# EAGLE design zxuno (EAGLE 6.5.0)
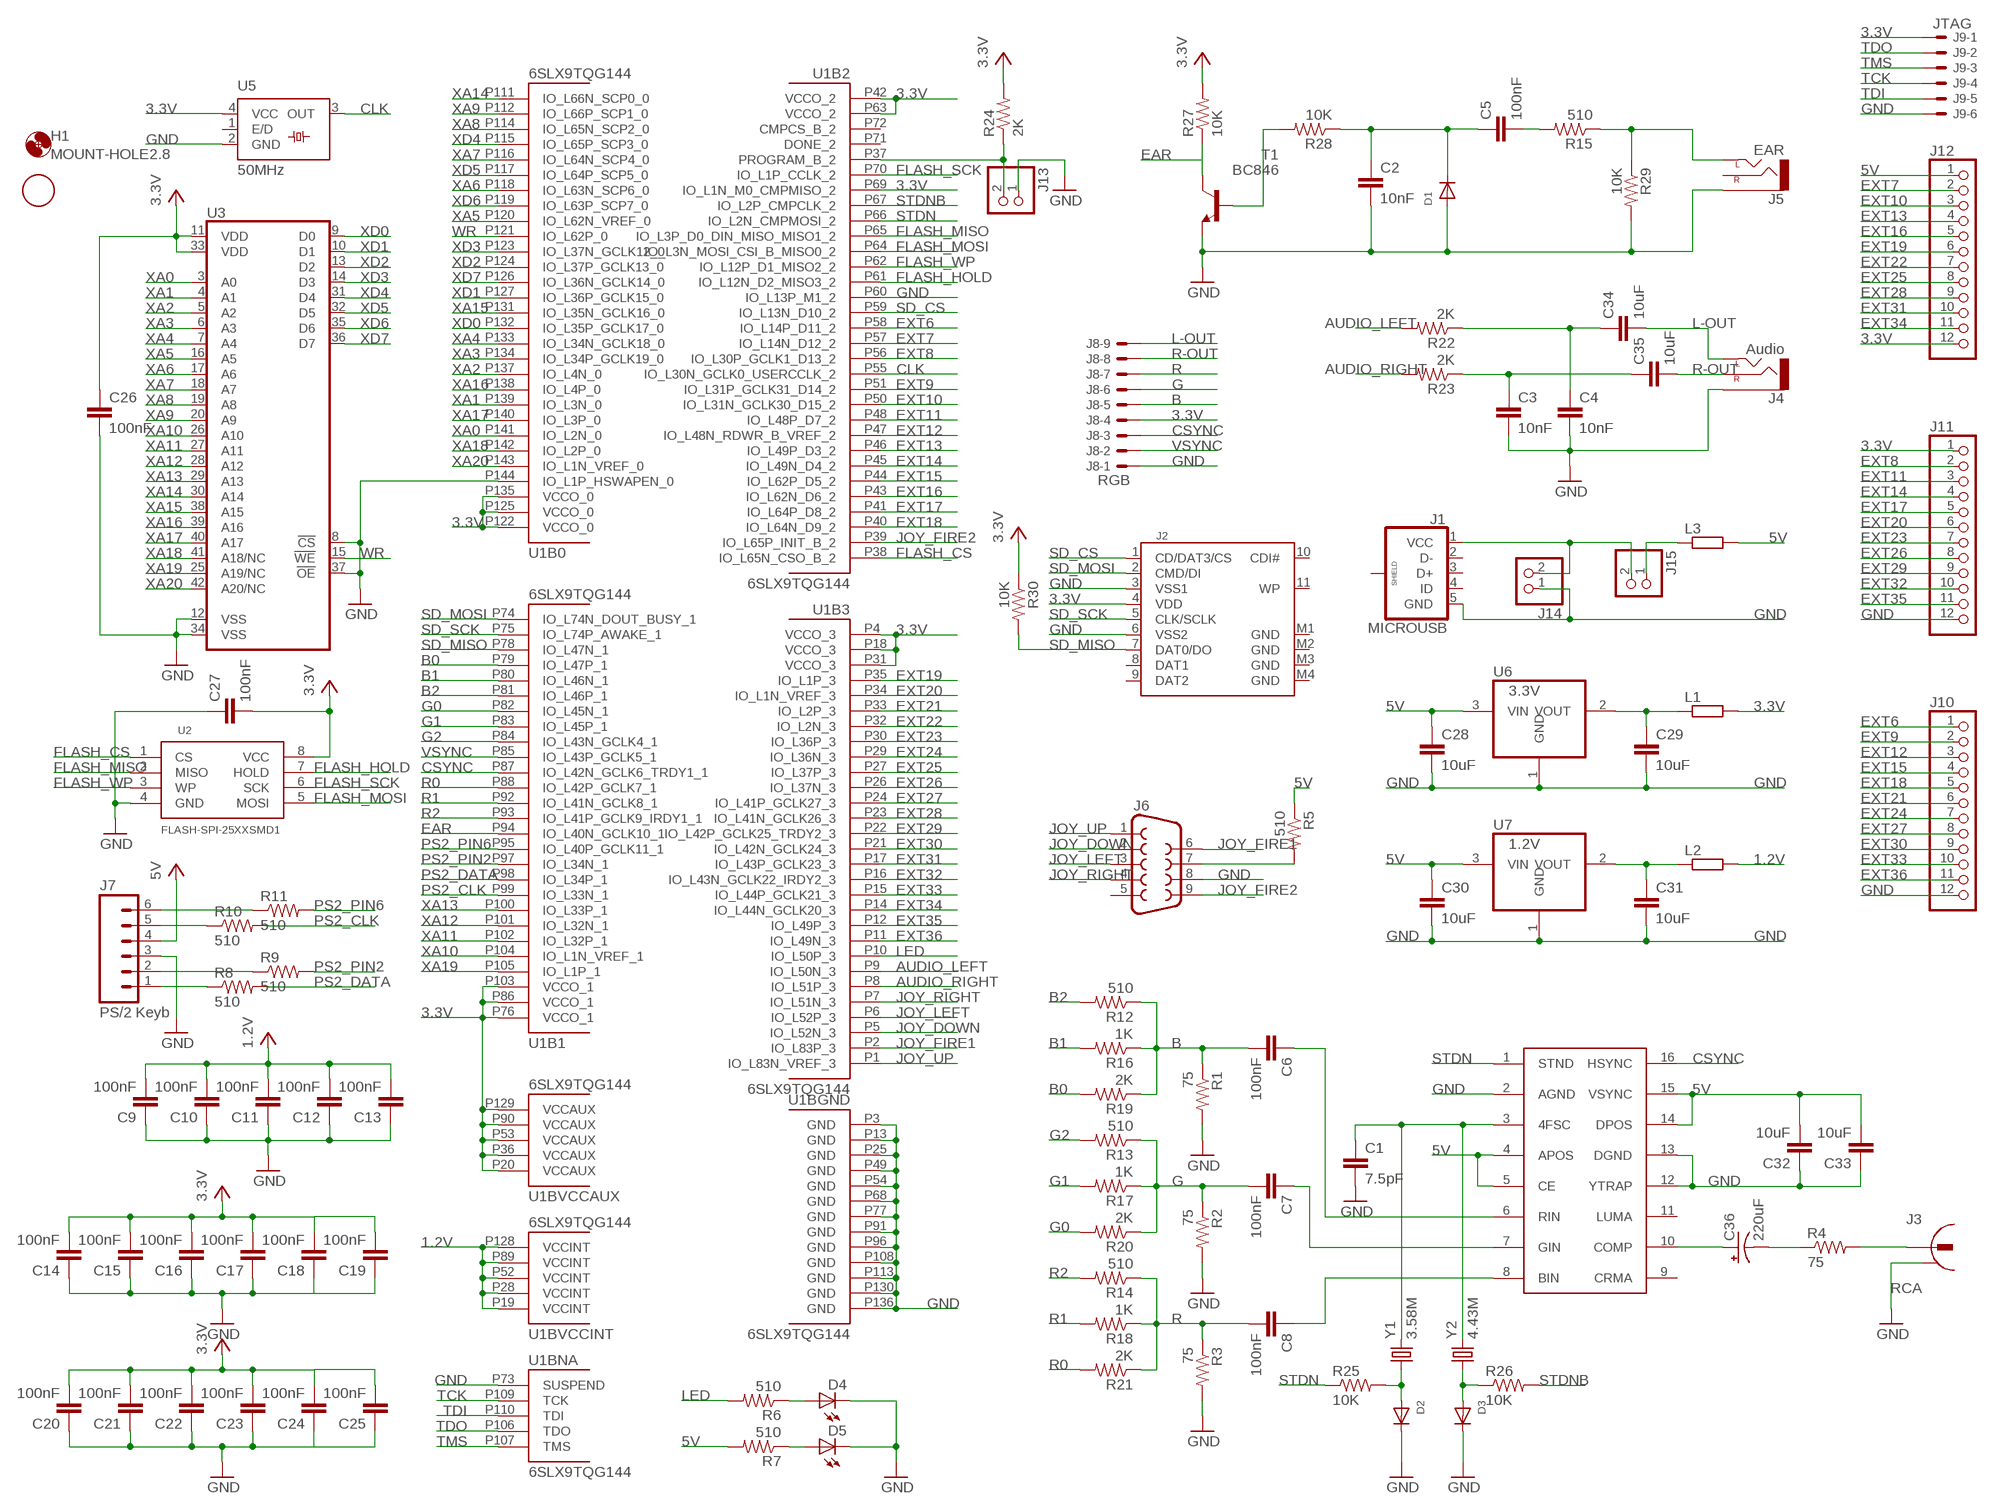
[diagram p0: schematic, sheet 1]

## Parts
C1  7.5pF  C-EUC0805  [C0805]
C2  10nF  C-EUC0805  [C0805]
C3  10nF  C-EUC0805  [C0805]
C4  10nF  C-EUC0805  [C0805]
C5  100nF  C-EUC0603  [C0603]
C6  100nF  C-EUC0603  [C0603]
C7  100nF  C-EUC0603  [C0603]
C8  100nF  C-EUC0603  [C0603]
C9  100nF  C-EUC0603  [C0603]
C10  100nF  C-EUC0603  [C0603]
C11  100nF  C-EUC0603  [C0603]
C12  100nF  C-EUC0603  [C0603]
C13  100nF  C-EUC0603  [C0603]
C14  100nF  C-EUC0603  [C0603]
C15  100nF  C-EUC0603  [C0603]
C16  100nF  C-EUC0603  [C0603]
C17  100nF  C-EUC0603  [C0603]
C18  100nF  C-EUC0603  [C0603]
C19  100nF  C-EUC0603  [C0603]
C20  100nF  C-EUC0603  [C0603]
C21  100nF  C-EUC0603  [C0603]
C22  100nF  C-EUC0603  [C0603]
C23  100nF  C-EUC0603  [C0603]
C24  100nF  C-EUC0603  [C0603]
C25  100nF  C-EUC0603  [C0603]
C26  100nF  C-EUC0603  [C0603]
C27  100nF  C-EUC0603  [C0603]
C28  10uF  C-EUC0805  [C0805]
C29  10uF  C-EUC0805  [C0805]
C30  10uF  C-EUC0805  [C0805]
C31  10uF  C-EUC0805  [C0805]
C32  10uF  C-EUC0805  [C0805]
C33  10uF  C-EUC0805  [C0805]
C34  10uF  C-EUC0805  [C0805]
C35  10uF  C-EUC0805  [C0805]
C36  220uF  CPOL-US153CLV-0605  [153CLV-0605]
D1  DIODESOD-523  [SOD-523]
D2  DIODESOD-523  [SOD-523]
D3  DIODESOD-523  [SOD-523]
D4  LEDCHIP-LED0805  [CHIP-LED0805]
D5  LEDCHIP-LED0805  [CHIP-LED0805]
H1  MOUNT-HOLE2.8  [2,8]
J1  MICROUSB  [MICRO_USB_1PRIMARY]
J2  SDCARD  [SDCMF-10915W010]
J3  RCA  RCA_JACK_RCJ-04X_-_DUPLICATE_1  [RCA_JACK_RCJ-04X_-_DUPLICATE_1PRIMARY]
J4  Audio  AUDIO-JACKPTH  [AUDIO-JACK]
J5  EAR  AUDIO-JACKPTH  [AUDIO-JACK]
J6  DB9MALE  [DB9_MALE]
J7  PS/2 Keyb  DINC_MIN_TM_6_1  [DINC/MIN_TM/6_1PRIMARY]
J8  RGB  53048-09  [53048-09]
J9  JTAG  53047-06  [53047-06]
J10  PINHD-1X12  [1X12]
J11  PINHD-1X12  [1X12]
J12  PINHD-1X12  [1X12]
J13  PINHD-1X2  [1X02]
J14  PINHD-1X2  [1X02]
J15  PINHD-1X2  [1X02]
L1  R-EU_M0805  [M0805]
L2  R-EU_M0805  [M0805]
L3  R-EU_M0805  [M0805]
R1  75  R-US_M0805  [M0805]
R2  75  R-US_M0805  [M0805]
R3  75  R-US_M0805  [M0805]
R4  75  R-US_M0805  [M0805]
R5  510  R-US_M0805  [M0805]
R6  510  R-US_M0805  [M0805]
R7  510  R-US_M0805  [M0805]
R8  510  R-US_M0805  [M0805]
R9  510  R-US_M0805  [M0805]
R10  510  R-US_M0805  [M0805]
R11  510  R-US_M0805  [M0805]
R12  510  R-US_M0805  [M0805]
R13  510  R-US_M0805  [M0805]
R14  510  R-US_M0805  [M0805]
R15  510  R-US_M0805  [M0805]
R16  1K  R-US_M0805  [M0805]
R17  1K  R-US_M0805  [M0805]
R18  1K  R-US_M0805  [M0805]
R19  2K  R-US_M0805  [M0805]
R20  2K  R-US_M0805  [M0805]
R21  2K  R-US_M0805  [M0805]
R22  2K  R-US_M0805  [M0805]
R23  2K  R-US_M0805  [M0805]
R24  2K  R-US_M0805  [M0805]
R25  10K  R-US_M0805  [M0805]
R26  10K  R-US_M0805  [M0805]
R27  10K  R-US_M0805  [M0805]
R28  10K  R-US_M0805  [M0805]
R29  10K  R-US_M0805  [M0805]
R30  10K  R-US_M0805  [M0805]
T1  BC846  [SOT23]
U1  6SLX9TQG144  [TQ144]
U2  FLASH-SPI-25XXSMD1  [SO08-EIAJ]
U3  ISSI_SRAM_8BIT  [TSOP44-II]
U4  AD724  AD725  [SO16W]
U5  50MHz  SM_OSC_1  [SM/OSC_1PRIMARY]
U6  3.3V  REG1117  [SOT223]
U7  1.2V  REG1117  [SOT223]
U$1  FIDUCIAL  [FIDUCIAL_1MM]
Y1  3.58M  CRYSTALHC49UP  [HC49UP]
Y2  4.43M  CRYSTALHC49UP  [HC49UP]

## Nets
1.2V: C9.2 C10.2 C11.2 C12.2 C13.2 L2.2 U1.P19(BVCCINT:VCCINT) U1.P28(BVCCINT:VCCINT) U1.P52(BVCCINT:VCCINT) U1.P89(BVCCINT:VCCINT) U1.P128(BVCCINT:VCCINT)
3.3V: C14.2 C15.2 C16.2 C17.2 C18.2 C19.2 C20.2 C21.2 C22.2 C23.2 C24.2 C25.2 C26.1 C27.2 J2.4(VDD) J8.4 J9.1 J11.1 J12.12 L1.2 R24.2 R27.2 R30.1 U1.P4(B3:VCCO_3) U1.P18(B3:VCCO_3) U1.P20(BVCCAUX:VCCAUX) U1.P31(B3:VCCO_3) U1.P36(BVCCAUX:VCCAUX) U1.P42(B2:VCCO_2) U1.P53(BVCCAUX:VCCAUX) U1.P63(B2:VCCO_2) U1.P69(B2:IO_L1N_M0_CMPMISO_2) U1.P76(B1:VCCO_1) U1.P86(B1:VCCO_1) U1.P90(BVCCAUX:VCCAUX) U1.P103(B1:VCCO_1) U1.P122(B0:VCCO_0) U1.P125(B0:VCCO_0) U1.P129(BVCCAUX:VCCAUX) U1.P135(B0:VCCO_0) U2.8(VCC) U3.11(VDD) U3.33(VDD) U5.4(VCC)
5V: C28.1 C30.1 C32.2 C33.2 J7.4 J12.1 L3.2 R5.1 R7.2 U4.4(APOS) U4.5(CE) U4.14(DPOS) U4.15(VSYNC) U6.3(VIN) U7.3(VIN)
AUDIO_LEFT: R22.2 U1.P9(B3:IO_L50N_3)
AUDIO_RIGHT: R23.2 U1.P8(B3:IO_L51P_3)
B: C6.2 J8.5 R1.1 R12.1 R16.1 R19.1
B0: R19.2 U1.P79(B1:IO_L47P_1)
B1: R16.2 U1.P80(B1:IO_L46N_1)
B2: R12.2 U1.P81(B1:IO_L46P_1)
CLK: U1.P55(B2:IO_L30N_GCLK0_USERCCLK_2) U5.3(OUT)
CSYNC: J8.3 U1.P87(B1:IO_L42N_GCLK6_TRDY1_1) U4.16(HSYNC)
EAR: R27.1 T1.3(C) U1.P94(B1:IO_L40N_GCLK10_1)
EXT6: J10.1 U1.P58(B2:IO_L14P_D11_2)
EXT7: J12.2 U1.P57(B2:IO_L14N_D12_2)
EXT8: J11.2 U1.P56(B2:IO_L30P_GCLK1_D13_2)
EXT9: J10.2 U1.P51(B2:IO_L31P_GCLK31_D14_2)
EXT10: J12.3 U1.P50(B2:IO_L31N_GCLK30_D15_2)
EXT11: J11.3 U1.P48(B2:IO_L48P_D7_2)
EXT12: J10.3 U1.P47(B2:IO_L48N_RDWR_B_VREF_2)
EXT13: J12.4 U1.P46(B2:IO_L49P_D3_2)
EXT14: J11.4 U1.P45(B2:IO_L49N_D4_2)
EXT15: J10.4 U1.P44(B2:IO_L62P_D5_2)
EXT16: J12.5 U1.P43(B2:IO_L62N_D6_2)
EXT17: J11.5 U1.P41(B2:IO_L64P_D8_2)
EXT18: J10.5 U1.P40(B2:IO_L64N_D9_2)
EXT19: J12.6 U1.P35(B3:IO_L1P_3)
EXT20: J11.6 U1.P34(B3:IO_L1N_VREF_3)
EXT21: J10.6 U1.P33(B3:IO_L2P_3)
EXT22: J12.7 U1.P32(B3:IO_L2N_3)
EXT23: J11.7 U1.P30(B3:IO_L36P_3)
EXT24: J10.7 U1.P29(B3:IO_L36N_3)
EXT25: J12.8 U1.P27(B3:IO_L37P_3)
EXT26: J11.8 U1.P26(B3:IO_L37N_3)
EXT27: J10.8 U1.P24(B3:IO_L41P_GCLK27_3)
EXT28: J12.9 U1.P23(B3:IO_L41N_GCLK26_3)
EXT29: J11.9 U1.P22(B3:IO_L42P_GCLK25_TRDY2_3)
EXT30: J10.9 U1.P21(B3:IO_L42N_GCLK24_3)
EXT31: J12.10 U1.P17(B3:IO_L43P_GCLK23_3)
EXT32: J11.10 U1.P16(B3:IO_L43N_GCLK22_IRDY2_3)
EXT33: J10.10 U1.P15(B3:IO_L44P_GCLK21_3)
EXT34: J12.11 U1.P14(B3:IO_L44N_GCLK20_3)
EXT35: J11.11 U1.P12(B3:IO_L49P_3)
EXT36: J10.11 U1.P11(B3:IO_L49N_3)
FLASH_CS: U1.P38(B2:IO_L65N_CSO_B_2) U2.1(CS)
FLASH_HOLD: U1.P61(B2:IO_L12N_D2_MISO3_2) U2.7(HOLD)
FLASH_MISO: U1.P65(B2:IO_L3P_D0_DIN_MISO_MISO1_2) U2.2(MISO)
FLASH_MOSI: U1.P64(B2:IO_L3N_MOSI_CSI_B_MISO0_2) U2.5(MOSI)
FLASH_SCK: U1.P70(B2:IO_L1P_CCLK_2) U2.6(SCK)
FLASH_WP: U1.P62(B2:IO_L12P_D1_MISO2_2) U2.3(WP)
G: C7.2 J8.6 R2.1 R13.1 R17.1 R20.1
G0: R20.2 U1.P82(B1:IO_L45N_1)
G1: R17.2 U1.P83(B1:IO_L45P_1)
G2: R13.2 U1.P84(B1:IO_L43N_GCLK4_1)
GND: C1.2 C2.2 C3.2 C4.2 C9.1 C10.1 C11.1 C12.1 C13.1 C14.1 C15.1 C16.1 C17.1 C18.1 C19.1 C20.1 C21.1 C22.1 C23.1 C24.1 C25.1 C26.2 C27.1 C28.2 C29.2 C30.2 C31.2 C32.1 C33.1 D1.A D2.K(C) D3.K(C) D4.C D5.C J1.5(GND) J2.3(VSS1) J2.6(VSS2) J3.4 J4.SLEEVE J5.SLEEVE J6.8 J7.3 J8.1 J9.6 J10.12 J11.12 J13.1 J14.1 R1.2 R2.2 R3.2 R29.2 T1.2(E) U1.P3(BGND:GND) U1.P13(BGND:GND) U1.P25(BGND:GND) U1.P49(BGND:GND) U1.P54(BGND:GND) U1.P60(B2:IO_L13P_M1_2) U1.P68(BGND:GND) U1.P73(BNA:SUSPEND) U1.P77(BGND:GND) U1.P91(BGND:GND) U1.P96(BGND:GND) U1.P108(BGND:GND) U1.P113(BGND:GND) U1.P130(BGND:GND) U1.P136(BGND:GND) U1.P144(B0:IO_L1P_HSWAPEN_0) U2.4(GND) U3.8(!CS) U3.12(VSS) U3.34(VSS) U3.37(!OE) U4.2(AGND) U4.12(YTRAP) U4.13(DGND) U5.2(GND) U6.1(GND) U7.1(GND)
JOY_DOWN: J6.2 U1.P5(B3:IO_L52N_3)
JOY_FIRE1: J6.6 U1.P2(B3:IO_L83P_3)
JOY_FIRE2: J6.9 U1.P39(B2:IO_L65P_INIT_B_2)
JOY_LEFT: J6.3 U1.P6(B3:IO_L52P_3)
JOY_RIGHT: J6.4 U1.P7(B3:IO_L51N_3)
JOY_UP: J6.1 U1.P1(B3:IO_L83N_VREF_3)
L-OUT: C34.2 J4.TIP(LEFT) J8.9
LED: R6.2 U1.P10(B3:IO_L50P_3)
N$1: J7.6 R11.1
N$2: J7.5 R10.1
N$3: J7.2 R9.1
N$4: J7.1 R8.1
N$5: J13.2 R24.1 U1.P37(B2:PROGRAM_B_2)
N$6: R28.2 T1.1(B)
N$7: C2.1 C5.1 D1.K(C) R28.1
N$8: C5.2 R15.2
N$9: J5.TIP(LEFT) R15.1 R29.1
N$10: C3.1 C35.1 R23.1
N$11: C4.1 C34.1 R22.1
N$12: J1.1(VCC) J14.2 J15.2
N$13: J15.1 L3.1
N$14: C29.1 L1.1 U6.2(VOUT)
N$15: J6.7 R5.2
N$17: C31.1 L2.1 U7.2(VOUT)
N$19: C8.1 U4.8(BIN)
N$21: C7.1 U4.7(GIN)
N$22: C6.1 U4.6(RIN)
N$23: C1.1 U4.3(4FSC) Y1.2 Y2.2
N$24: D3.A R26.1 Y2.1
N$25: D2.A R25.2 Y1.1
N$26: C36.+ U4.10(COMP)
N$27: C36.- R4.1
N$28: J3.3 R4.2
N$31: D4.A R6.1
N$32: D5.A R7.1
PS2_CLK: R10.2 U1.P99(B1:IO_L33N_1)
PS2_DATA: R8.2 U1.P98(B1:IO_L34P_1)
PS2_PIN2: R9.2 U1.P97(B1:IO_L34N_1)
PS2_PIN6: R11.2 U1.P95(B1:IO_L40P_GCLK11_1)
R: C8.2 J8.7 R3.1 R14.1 R18.1 R21.1
R0: R21.2 U1.P88(B1:IO_L42P_GCLK7_1)
R1: R18.2 U1.P92(B1:IO_L41N_GCLK8_1)
R2: R14.2 U1.P93(B1:IO_L41P_GCLK9_IRDY1_1)
R-OUT: C35.2 J4.RING(RIGHT) J8.8
SD_CS: J2.1(CD/DAT3/CS) U1.P59(B2:IO_L13N_D10_2)
SD_MISO: J2.7(DAT0/DO) R30.2 U1.P78(B1:IO_L47N_1)
SD_MOSI: J2.2(CMD/DI) U1.P74(B1:IO_L74N_DOUT_BUSY_1)
SD_SCK: J2.5(CLK/SCLK) U1.P75(B1:IO_L74P_AWAKE_1)
STDN: R25.1 U1.P66(B2:IO_L2N_CMPMOSI_2) U4.1(STND)
STDNB: R26.2 U1.P67(B2:IO_L2P_CMPCLK_2)
TCK: J9.4 U1.P109(BNA:TCK)
TDI: J9.5 U1.P110(BNA:TDI)
TDO: J9.2 U1.P106(BNA:TDO)
TMS: J9.3 U1.P107(BNA:TMS)
VSYNC: J8.2 U1.P85(B1:IO_L43P_GCLK5_1)
WR: U1.P121(B0:IO_L62P_0) U3.15(!WE)
XA0: U1.P141(B0:IO_L2N_0) U3.3(A0)
XA1: U1.P139(B0:IO_L3N_0) U3.4(A1)
XA2: U1.P137(B0:IO_L4N_0) U3.5(A2)
XA3: U1.P134(B0:IO_L34P_GCLK19_0) U3.6(A3)
XA4: U1.P133(B0:IO_L34N_GCLK18_0) U3.7(A4)
XA5: U1.P120(B0:IO_L62N_VREF_0) U3.16(A5)
XA6: U1.P118(B0:IO_L63N_SCP6_0) U3.17(A6)
XA7: U1.P116(B0:IO_L64N_SCP4_0) U3.18(A7)
XA8: U1.P114(B0:IO_L65N_SCP2_0) U3.19(A8)
XA9: U1.P112(B0:IO_L66P_SCP1_0) U3.20(A9)
XA10: U1.P104(B1:IO_L1N_VREF_1) U3.26(A10)
XA11: U1.P102(B1:IO_L32P_1) U3.27(A11)
XA12: U1.P101(B1:IO_L32N_1) U3.28(A12)
XA13: U1.P100(B1:IO_L33P_1) U3.29(A13)
XA14: U1.P111(B0:IO_L66N_SCP0_0) U3.30(A14)
XA15: U1.P131(B0:IO_L35N_GCLK16_0) U3.38(A15)
XA16: U1.P138(B0:IO_L4P_0) U3.39(A16)
XA17: U1.P140(B0:IO_L3P_0) U3.40(A17)
XA18: U1.P142(B0:IO_L2P_0) U3.41(A18/NC)
XA19: U1.P105(B1:IO_L1P_1) U3.25(A19/NC)
XA20: U1.P143(B0:IO_L1N_VREF_0) U3.42(A20/NC)
XD0: U1.P132(B0:IO_L35P_GCLK17_0) U3.9(D0)
XD1: U1.P127(B0:IO_L36P_GCLK15_0) U3.10(D1)
XD2: U1.P124(B0:IO_L37P_GCLK13_0) U3.13(D2)
XD3: U1.P123(B0:IO_L37N_GCLK12_0) U3.14(D3)
XD4: U1.P115(B0:IO_L65P_SCP3_0) U3.31(D4)
XD5: U1.P117(B0:IO_L64P_SCP5_0) U3.32(D5)
XD6: U1.P119(B0:IO_L63P_SCP7_0) U3.35(D6)
XD7: U1.P126(B0:IO_L36N_GCLK14_0) U3.36(D7)
Unconnected: J1.2(D-) J1.3(D+) J1.4(ID) J1.6(SHIELD) J2.8(DAT1) J2.9(DAT2) J2.10(CDI#) J2.11(WP) J5.RING(RIGHT) J6.5 U1.P71(B2:DONE_2) U1.P72(B2:CMPCS_B_2) U4.9(CRMA) U4.11(LUMA) U5.1(E/D)

## Power pins joined to a net without a drawn wire
GND: J2.M1(GND) J2.M2(GND) J2.M3(GND) J2.M4(GND)

## Library data of the parts
C1-C35 = rcl:C-EU: CAPACITOR, European symbol
C36 = rcl:CPOL-US: POLARIZED CAPACITOR, American symbol
D1-D3 = adafruit:DIODE: Diode SMADIODE - SMA Surface Mount Package 20V 1A Schottky Diode Digikey: 641-1014-6-ND DO-1N4148 - Through Hole Small Current Diode SOD-123 20V 1 A (.5mV Vf) Schottky Diode - Digikey: MBRX120TPMSCT-ND SOD-323 10V 570mA (.38mV Vf, 3ns) Schottky Diode - Digikey: ZLLS410CT-ND SOD-523 30V 30mA Schottky Diode (RB751S-40TE61) - Digikey: RB751S-40TE61CT-ND SOT23-R/W - SOT23 Package (R = Solder Paste/Reflow Ovens, W = Hand-Soldering) BAT54Film 40V 300mA - Digikey: 497-7162-1-ND
D4 D5 = led:LED: LED OSRAM: - CHIPLED LG R971, LG N971, LY N971, LG Q971, LY Q971, LO R971, LY R971 LH N974, LH R974 LS Q976, LO Q976, LY Q976 LO Q996 - Hyper CHIPLED LW Q18S LB Q993, LB Q99A, LB R99A - SideLED LS A670, LO A670, LY A670, LG A670, LP A670 LB A673, LV A673, LT A673, LW A673 LH A674 LY A675 LS A676, LA A676, LO A676, LY A676, LW A676 LS A679, LY A679, LG A679 - Hyper Micro SIDELED® LS Y876, LA Y876, LO Y876, LY Y876 LT Y87S - SmartLED LW L88C, LW L88S LB L89C, LB L89S, LG L890 LS L89K, LO L89K, LY L89K LS L896, LA L896, LO L896, LY L896 - TOPLED LS T670, LO T670, LY T670, LG T670, LP T670 LSG T670, LSP T670, LSY T670, LOP T670, LYG T670 LG T671, LOG T671, LSG T671 LB T673, LV T673, LT T673, LW T673 LH T674 LS T676, LA T676, LO T676, LY T676, LB T676, LH T676, LSB T676, LW T676 LB T67C, LV T67C, LT T67C, LS T67K, LO T67K, LY T67K, LW E67C LS E67B, LA E67B, LO E67B, LY E67B, LB E67C, LV E67C, LT E67C LW T67C LS T679, LY T679, LG T679 LS T770, LO T770, LY T770, LG T770, LP T770 LB T773, LV T773, LT T773, LW T773 LH T774 LS E675, LA E675, LY E675, LS T675 LS T776, LA T776, LO T776, LY T776, LB T776 LHGB T686 LT T68C, LB T68C - Hyper Mini TOPLED® LB M676 - Mini TOPLED Santana® LG M470 LS M47K, LO M47K, LY M47K Source: http://www.osram.convergy.de LUXEON: - LUMILED® LXK2-PW12-R00, LXK2-PW12-S00, LXK2-PW14-U00, LXK2-PW14-V00 LXK2-PM12-R00, LXK2-PM12-S00, LXK2-PM14-U00 LXK2-PE12-Q00, LXK2-PE12-R00, LXK2-PE12-S00, LXK2-PE14-T00, LXK2-PE14-U00 LXK2-PB12-K00, LXK2-PB12-L00, LXK2-PB12-M00, LXK2-PB14-N00, LXK2-PB14-P00, LXK2-PB14-Q00 LXK2-PR12-L00, LXK2-PR12-M00, LXK2-PR14-Q00, LXK2-PR14-R00 LXK2-PD12-Q00, LXK2-PD12-R00, LXK2-PD12-S00 LXK2-PH12-R00, LXK2-PH12-S00 LXK2-PL12-P00, LXK2-PL12-Q00, LXK2-PL12-R00 Source: www.luxeon.com KINGBRIGHT: KA-3528ASYC Source: www.kingbright.com
H1 = holes:MOUNT-HOLE: MOUNTING HOLE with drill center marker
J1 = ZX_UNO_A-:MICROUSB
J2 = sd-mmc:SDCARD: SD card connector KINGFONT SDCMF-10915W010
J3 = ZX_UNO_0_15:RCA_JACK_RCJ-04X_-_DUPLICATE_1
J4 J5 = SparkFun-Connectors:AUDIO-JACK: 3.5mm Audio Jack Simple 3.5mm common PCB mount audio jack. SKU: PRT-08032
J6 = SparkFun-Connectors:DB9: DB9 Connector Standard DB9 (D-Sub 9) serial connector. Can be used for CAN bus as well as RS485 and RS232. Footprint production proven. Spark Fun Electronics SKU : PRT-00429
J7 = ZX_UNO_0_14:DINC_MIN_TM_6_1
J8 = con-molex:53?-09: CONNECTOR wire to board 1.25 mm (.049 inch) pitch header; MPN: 53048-0910; OC_FARNELL: 1012239; OC_NEWARK: 98K9837
J9 = con-molex:53?-06: CONNECTOR wire to board 1.25 mm (.049 inch) pitch header; MPN: 53047-0610-C; OC_FARNELL: 9733078; OC_NEWARK: 03M2965
J10-J12 = pinhead:PINHD-1X12: PIN HEADER
J13-J15 = pinhead:PINHD-1X2: PIN HEADER
L1-L3 = rcl:R-EU_: RESISTOR, European symbol
R1-R30 = rcl:R-US_: RESISTOR, American symbol
T1 = transistor:BC846: NPN TRANSISTOR
U1 = xilinx_devices_V6:6SLX9TQG144: Xilinx FPGA: 6SLX9TQG144
U2 = GadgetFactory:FLASH-SPI-25XX: SPI Flash
U3 = GadgetFactory:ISSI_SRAM_8BIT
U4 = ad725:AD725
U5 = ZX_UNO_0_15:SM_OSC_1
U6 U7 = burr-brown:REG1117: 800mA and 1A Low Dropout (LDO) Positive Regulator 1.8V, 2.5V, 2.85V, 3.3V, 5V, and Adj; MPN: REG1117; OC_FARNELL: 1097566; OC_NEWARK: 14P6981
U$1 = adafruit:FIDUCIAL: For use by pick and place machines to calibrate the vision/machine, 1mm By microbuilder.eu
Y1 Y2 = crystal:CRYSTAL: CRYSTAL; OC_FARNELL: unknown; OC_NEWARK: unknown

## Board
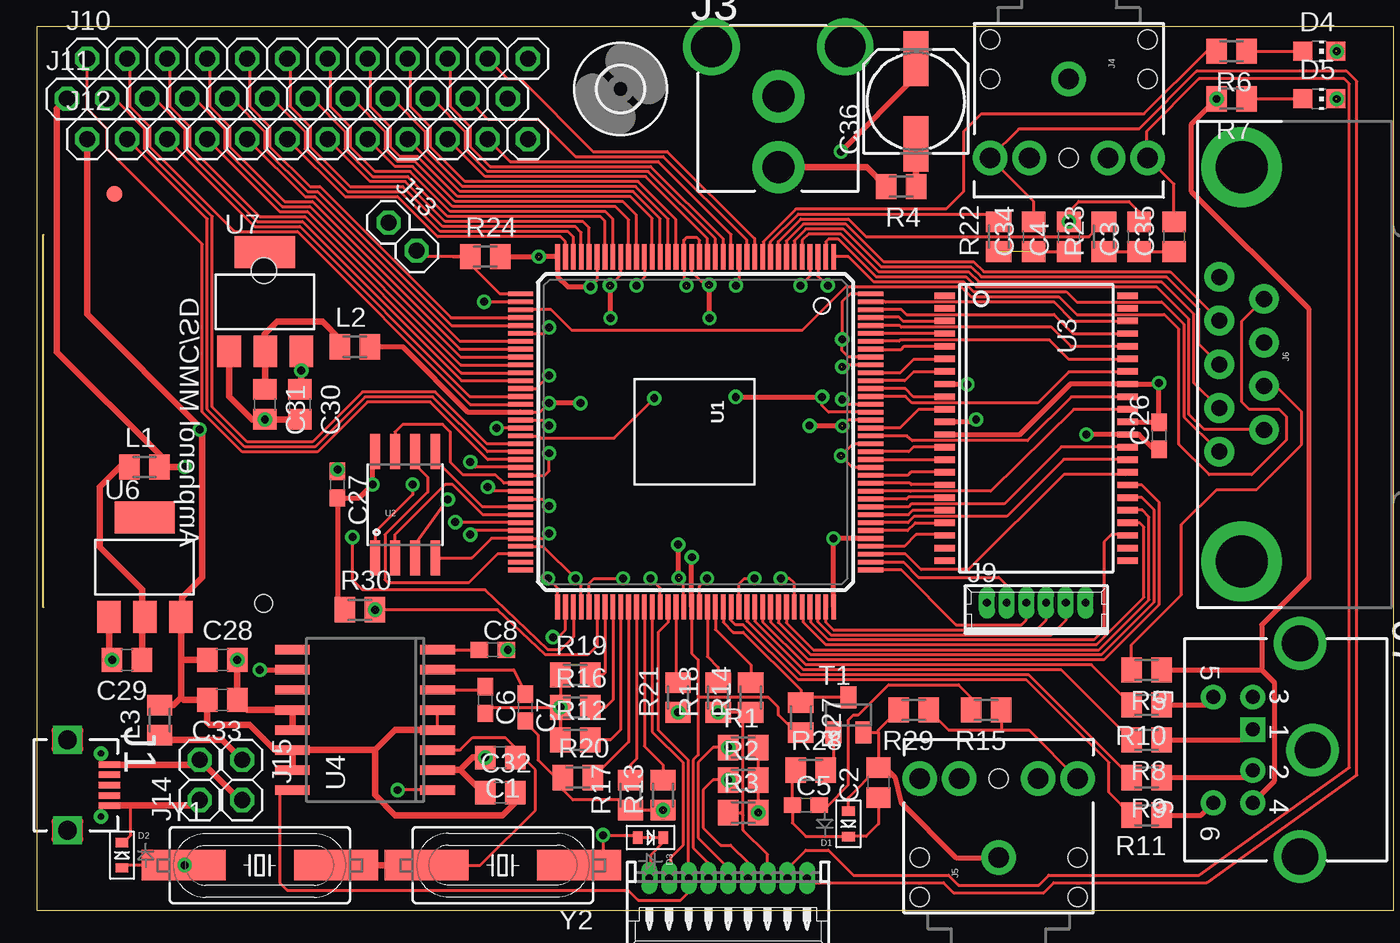
[diagram p1: board, top side]
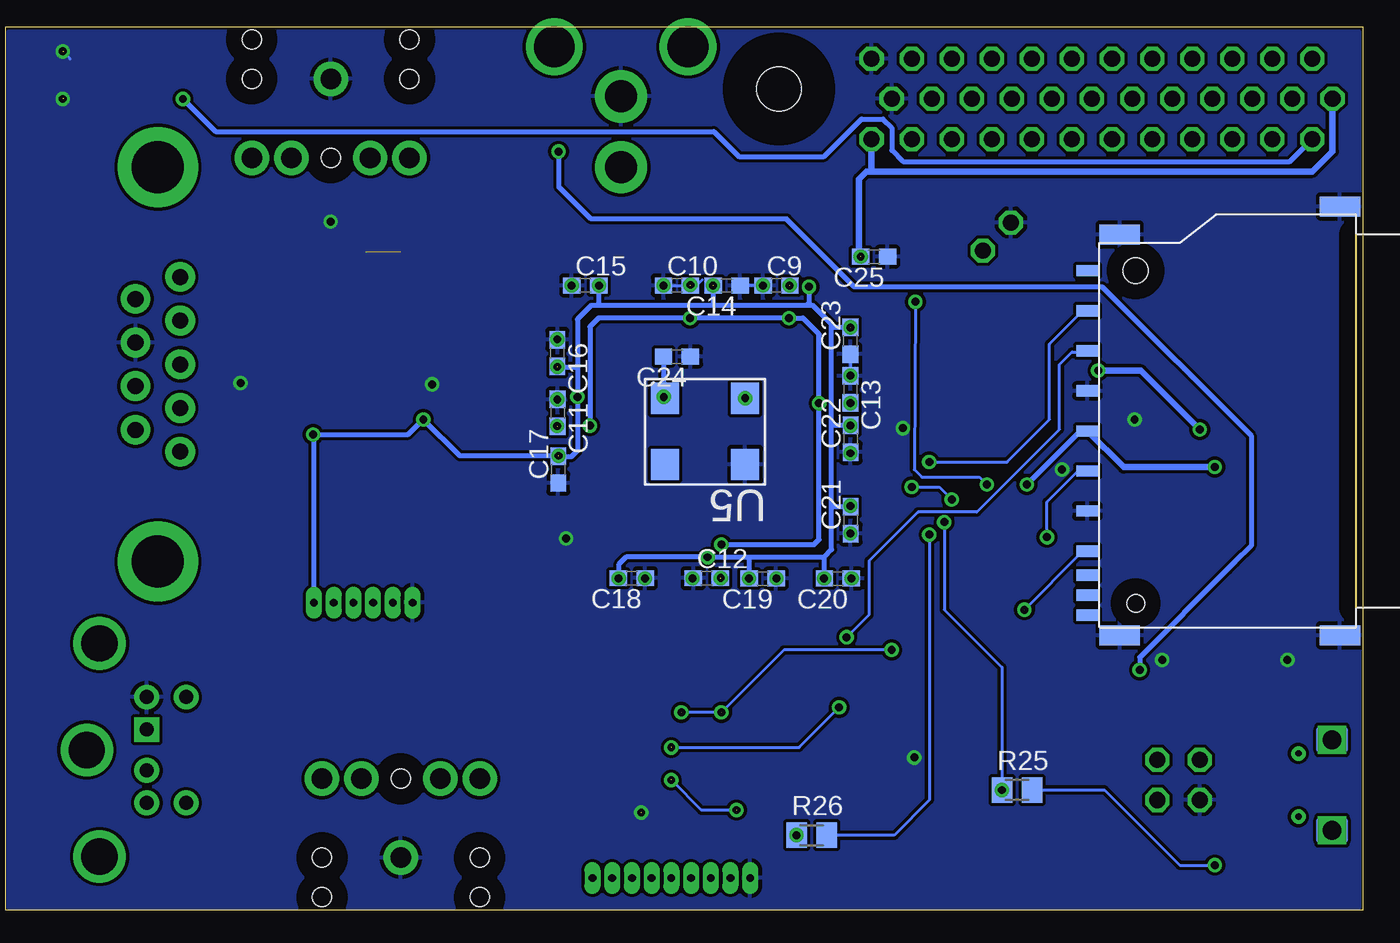
[diagram p2: board, bottom side, seen from below]

Size 0 x 23.62 mm. Coordinates in mm from the lower left corner, seen from the top.
Copper layers (1*16): Top 0.035mm / dielectric 1.5mm / Bottom 0.035mm
Design rules "default": minimum track width 10mil, minimum drill 24mil, track to track 8mil, track to pad 8mil, pad to pad 8mil, via to via 8mil, smd to smd 8mil, copper to edge 40mil, drill to drill 8mil, minimum pad ring 10mil, minimum via ring 8mil, stop-mask expansion 4mil, vias tented up to drill 0mil, thermal gap 10mil
Milling: 4 lines

### Footprints (pad centres in the part's own frame; a part is rotated, then mirrored left to right if it is on the bottom)
C0805 = smd 1.3 x 1.5: 1 -0.95,0; 2 0.95,0
C0603 = smd 1.1 x 1: 1 -0.85,0; 2 0.85,0
153CLV-0605 = smd 3.5 x 1.6: + 2.7,0; - -2.7,0
SOD-523 = smd 0.8 x 0.6: A 0,-0.8; K 0,0.8
CHIP-LED0805 = smd 1.2 x 1.2: A 0,-1.05; C 0,1.05
2,8 = hole 2.8: 0,0
MICRO_USB_1PRIMARY = smd 0.406 x 1.346: 1 -1.295,0; 2 -0.66,0; 3 0,0; 4 0.66,0; 5 1.295,0 | drill 0.406 pad 0.406: 6 2.007,-0.533; 7 -2.007,-0.533 | drill 1.194 pad 1.538 square: 8 -2.87,-2.667; 9 2.87,-2.667
SDCMF-10915W010 = smd 0.711 x 1.422: 1 7.366,13.462; 2 4.826,13.462; 3 2.286,13.462; 4 -0.254,13.462; 5 -2.794,13.462; 6 -5.334,13.462; 7 -7.874,13.462; 8 -9.398,13.462; 9 9.906,13.462; 10 -11.938,13.462; 11 -10.668,13.462 | smd 1.27 x 2.54: M1 12.192,11.43; M2 13.97,-2.54; M3 -13.208,-2.54; M4 -13.208,11.43 | hole 1.6: 9.906,10.414 | hole 1.1: -11.176,10.414
RCA_JACK_RCJ-04X_-_DUPLICATE_1PRIMARY = drill 2.591 pad 2.591: 1 4.242,3.15; 2 -4.242,3.15 | drill 2.032 pad 3.302: 3 0,-4.496; 4 0,0
AUDIO-JACK = drill 1.3 pad 2.184: RING 5,5; RSH 5,2.5; SLEEVE 0,0; TIP 5,-5; TSH 5,-2.5 | hole 1.2: 0,5; -2.5,5; -2.5,-5; 0,-5; 5,0
DB9_MALE = drill 1.016 pad 1.88: 1 5.54,-1.42; 2 2.77,-1.42; 3 0,-1.42; 4 -2.77,-1.42; 5 -5.54,-1.42; 6 4.15,1.42; 7 1.38,1.42; 8 -1.38,1.42; 9 -4.15,1.42 | drill 3.302 pad 5.08: G1 -12.5,0; G2 12.5,0
DINC/MIN_TM/6_1PRIMARY = drill 0.889 pad 1.575 square: 1 -1.295,-8.509 | drill 0.889 pad 1.575: 2 1.295,-8.509; 3 -3.353,-8.509; 4 3.353,-8.509; 5 -3.353,-10.998; 6 3.353,-10.998 | drill 2.311 pad 2.845: 7 -6.756,-5.512; 8 0,-4.699; 9 6.756,-5.512
53048-09 = drill 0.5 pad 0.698 long: 1 5,-1.25; 2 3.75,-1.25; 3 2.5,-1.25; 4 1.25,-1.25; 5 0,-1.25; 6 -1.25,-1.25; 7 -2.5,-1.25; 8 -3.75,-1.25; 9 -5,-1.25
53047-06 = drill 0.5 pad 0.698 long: 1 3.125,0.45; 2 1.875,0.45; 3 0.625,0.45; 4 -0.625,0.45; 5 -1.875,0.45; 6 -3.125,0.45
1X12 = drill 1.016 octagon: 1 -13.97,0; 2 -11.43,0; 3 -8.89,0; 4 -6.35,0; 5 -3.81,0; 6 -1.27,0; 7 1.27,0; 8 3.81,0; 9 6.35,0; 10 8.89,0; 11 11.43,0; 12 13.97,0
1X02 = drill 1.016 octagon: 1 -1.27,0; 2 1.27,0
M0805 = smd 1.3 x 1.6: 1 -0.95,0; 2 0.95,0
SOT23 = smd 1 x 1.4: 1 -0.95,-1.1; 2 0.95,-1.1; 3 0,1.1
TQ144 = smd 1.6 x 0.3: P1 -11.1,8.75; P2 -11.1,8.25; P3 -11.1,7.75; P4 -11.1,7.25; P5 -11.1,6.75; P6 -11.1,6.25; P7 -11.1,5.75; P8 -11.1,5.25; P9 -11.1,4.75; P10 -11.1,4.25; P11 -11.1,3.75; P12 -11.1,3.25; P13 -11.1,2.75; P14 -11.1,2.25; P15 -11.1,1.75; P16 -11.1,1.25; P17 -11.1,0.75; P18 -11.1,0.25; P19 -11.1,-0.25; P20 -11.1,-0.75; P21 -11.1,-1.25; P22 -11.1,-1.75; P23 -11.1,-2.25; P24 -11.1,-2.75; P25 -11.1,-3.25; P26 -11.1,-3.75; P27 -11.1,-4.25; P28 -11.1,-4.75; P29 -11.1,-5.25; P30 -11.1,-5.75; P31 -11.1,-6.25; P32 -11.1,-6.75; P33 -11.1,-7.25; P34 -11.1,-7.75; P35 -11.1,-8.25; P36 -11.1,-8.75; P73 11.1,-8.75; P74 11.1,-8.25; P75 11.1,-7.75; P76 11.1,-7.25; P77 11.1,-6.75; P78 11.1,-6.25; P79 11.1,-5.75; P80 11.1,-5.25; P81 11.1,-4.75; P82 11.1,-4.25; P83 11.1,-3.75; P84 11.1,-3.25; P85 11.1,-2.75; P86 11.1,-2.25; P87 11.1,-1.75; P88 11.1,-1.25; P89 11.1,-0.75; P90 11.1,-0.25; P91 11.1,0.25; P92 11.1,0.75; P93 11.1,1.25; P94 11.1,1.75; P95 11.1,2.25; P96 11.1,2.75; P97 11.1,3.25; P98 11.1,3.75; P99 11.1,4.25; P100 11.1,4.75; P101 11.1,5.25; P102 11.1,5.75; P103 11.1,6.25; P104 11.1,6.75; P105 11.1,7.25; P106 11.1,7.75; P107 11.1,8.25; P108 11.1,8.75 | smd 0.3 x 1.6: P37 -8.75,-11.1; P38 -8.25,-11.1; P39 -7.75,-11.1; P40 -7.25,-11.1; P41 -6.75,-11.1; P42 -6.25,-11.1; P43 -5.75,-11.1; P44 -5.25,-11.1; P45 -4.75,-11.1; P46 -4.25,-11.1; P47 -3.75,-11.1; P48 -3.25,-11.1; P49 -2.75,-11.1; P50 -2.25,-11.1; P51 -1.75,-11.1; P52 -1.25,-11.1; P53 -0.75,-11.1; P54 -0.25,-11.1; P55 0.25,-11.1; P56 0.75,-11.1; P57 1.25,-11.1; P58 1.75,-11.1; P59 2.25,-11.1; P60 2.75,-11.1; P61 3.25,-11.1; P62 3.75,-11.1; P63 4.25,-11.1; P64 4.75,-11.1; P65 5.25,-11.1; P66 5.75,-11.1; P67 6.25,-11.1; P68 6.75,-11.1; P69 7.25,-11.1; P70 7.75,-11.1; P71 8.25,-11.1; P72 8.75,-11.1; P109 8.75,11.1; P110 8.25,11.1; P111 7.75,11.1; P112 7.25,11.1; P113 6.75,11.1; P114 6.25,11.1; P115 5.75,11.1; P116 5.25,11.1; P117 4.75,11.1; P118 4.25,11.1; P119 3.75,11.1; P120 3.25,11.1; P121 2.75,11.1; P122 2.25,11.1; P123 1.75,11.1; P124 1.25,11.1; P125 0.75,11.1; P126 0.25,11.1; P127 -0.25,11.1; P128 -0.75,11.1; P129 -1.25,11.1; P130 -1.75,11.1; P131 -2.25,11.1; P132 -2.75,11.1; P133 -3.25,11.1; P134 -3.75,11.1; P135 -4.25,11.1; P136 -4.75,11.1; P137 -5.25,11.1; P138 -5.75,11.1; P139 -6.25,11.1; P140 -6.75,11.1; P141 -7.25,11.1; P142 -7.75,11.1; P143 -8.25,11.1; P144 -8.75,11.1
SO08-EIAJ = smd 0.61 x 2.21: 1 -1.905,-3.378; 2 -0.635,-3.378; 3 0.635,-3.378; 4 1.905,-3.378; 5 1.905,3.353; 6 0.635,3.353; 7 -0.635,3.353; 8 -1.905,3.353
TSOP44-II = smd 0.4 x 1.3: 1 -8.4,-5.8; 2 -7.6,-5.8; 3 -6.8,-5.8; 4 -6,-5.8; 5 -5.2,-5.8; 6 -4.4,-5.8; 7 -3.6,-5.8; 8 -2.8,-5.8; 9 -2,-5.8; 10 -1.2,-5.8; 11 -0.4,-5.8; 12 0.4,-5.8; 13 1.2,-5.8; 14 2,-5.8; 15 2.8,-5.8; 16 3.6,-5.8; 17 4.4,-5.8; 18 5.2,-5.8; 19 6,-5.8; 20 6.8,-5.8; 21 7.6,-5.8; 22 8.4,-5.8; 23 8.4,5.8; 24 7.6,5.8; 25 6.8,5.8; 26 6,5.8; 27 5.2,5.8; 28 4.4,5.8; 29 3.6,5.8; 30 2.8,5.8; 31 2,5.8; 32 1.2,5.8; 33 0.4,5.8; 34 -0.4,5.8; 35 -1.2,5.8; 36 -2,5.8; 37 -2.8,5.8; 38 -3.6,5.8; 39 -4.4,5.8; 40 -5.2,5.8; 41 -6,5.8; 42 -6.8,5.8; 43 -7.6,5.8; 44 -8.4,5.8
SO16W = smd 0.6 x 2.2: 1 -4.445,-4.6; 2 -3.175,-4.6; 3 -1.905,-4.6; 4 -0.635,-4.6; 5 0.635,-4.6; 6 1.905,-4.6; 7 3.175,-4.6; 8 4.445,-4.6; 9 4.445,4.6; 10 3.175,4.6; 11 1.905,4.6; 12 0.635,4.6; 13 -0.635,4.6; 14 -1.905,4.6; 15 -3.175,4.6; 16 -4.445,4.6
SM/OSC_1PRIMARY = smd 1.778 x 1.981: 1 0,0; 2 -5.08,0; 3 -5.08,-4.191; 4 0,-4.191
SOT223 = smd 1.499 x 2.007: 1 -2.261,-3.15; 2 0.025,-3.15; 3 2.311,-3.15 | smd 3.81 x 2.007: 4 0,3.15
FIDUCIAL_1MM = smd 1 x 1: 1 0,0
HC49UP = smd 5.334 x 1.93: 1 -4.826,0; 2 4.826,0

### Placement (x,y rotation side)
C1  28.96,-9.53 180 top  (outside the outline)
C2  52.93,-11.11 90 top  (outside the outline)
C3  69.44,23.49 90 top  (outside the outline)
C4  64.99,23.49 90 top  (outside the outline)
C5  48.32,-12.54 0 top  (outside the outline)
C6  28,-5.87 270 top  (outside the outline)
C7  30.54,-6.35 270 top  (outside the outline)
C8  28.48,-2.7 0 top  (outside the outline)
C9  36.73,20.4 0 bottom  (outside the outline)
C10  43.05,20.4 0 bottom  (outside the outline)
C11  50.61,12.32 270 bottom  (outside the outline)
C12  41.16,1.85 0 bottom  (outside the outline)
C13  32.05,13.81 270 bottom  (outside the outline)
C14  39.89,20.4 180 bottom  (outside the outline)
C15  48.86,20.4 0 bottom  (outside the outline)
C16  50.63,16.11 270 bottom  (outside the outline)
C17  50.57,8.73 90 bottom  (outside the outline)
C18  45.9,1.85 180 bottom  (outside the outline)
C19  37.61,1.83 180 bottom  (outside the outline)
C20  32.85,1.83 180 bottom  (outside the outline)
C21  32.03,5.52 90 bottom  (outside the outline)
C22  32.03,10.68 90 bottom  (outside the outline)
C23  32.05,16.89 90 bottom  (outside the outline)
C24  43.05,15.89 180 bottom  (outside the outline)
C25  30.54,22.23 180 bottom  (outside the outline)
C26  70.71,10.87 90 top  (outside the outline)
C27  18.64,7.78 270 top  (outside the outline)
C28  11.33,-3.33 0 top  (outside the outline)
C29  5.3,-3.33 180 top  (outside the outline)
C30  16.26,12.86 270 top  (outside the outline)
C31  14.03,12.86 270 top  (outside the outline)
C32  28.96,-11.75 0 top  (outside the outline)
C33  11.33,-5.87 180 top  (outside the outline)
C34  62.77,23.49 90 top  (outside the outline)
C35  71.66,23.49 90 top  (outside the outline)
C36  55.31,32.07 90 top  (outside the outline)
D1  51.02,-13.73 180 top  (outside the outline)
D2  4.98,-15.72 0 top  (outside the outline)
D3  38.48,-14.61 270 top  (outside the outline)
D4  80.87,35.24 270 top  (outside the outline)
D5  80.87,32.23 270 top  (outside the outline)
H1  36.58,32.86 0 top  (outside the outline)
J1  4.19,-11.27 270 top  (outside the outline)
J2  3.56,11.43 90 bottom
J3  46.58,32.38 0 top  (outside the outline)
J4  64.99,33.5 270 top  (outside the outline)
J5  60.55,-15.88 90 top  (outside the outline)
J6  75.95,15.4 270 top  (outside the outline)
J7  85.15,-9.05 270 top  (outside the outline)
J8  43.4,-18.42 180 top  (outside the outline)
J9  62.93,-0.16 0 top  (outside the outline)
J10  16.73,34.77 0 top  (outside the outline)
J11  15.46,32.23 0 top  (outside the outline)
J12  16.73,29.69 0 top  (outside the outline)
J13  22.76,23.49 315 top  (outside the outline)
J14  9.91,-10.95 90 top  (outside the outline)
J15  12.6,-10.95 270 top  (outside the outline)
L1  6.41,8.89 0 top  (outside the outline)
L2  19.75,16.51 0 top  (outside the outline)
L3  7.37,-7.14 90 top  (outside the outline)
R1  44.35,-8.89 0 top  (outside the outline)
R2  44.35,-10.95 0 top  (outside the outline)
R3  44.35,-13.02 0 top  (outside the outline)
R4  54.36,26.67 180 top  (outside the outline)
R5  69.91,-3.97 180 top  (outside the outline)
R6  75.31,35.24 180 top  (outside the outline)
R7  75.31,32.23 180 top  (outside the outline)
R8  69.91,-8.41 180 top  (outside the outline)
R9  69.91,-10.8 180 top  (outside the outline)
R10  69.91,-6.19 180 top  (outside the outline)
R11  69.91,-13.18 180 top  (outside the outline)
R12  33.72,-8.41 0 top  (outside the outline)
R13  39.27,-11.91 90 top  (outside the outline)
R14  44.83,-5.72 90 top  (outside the outline)
R15  59.75,-6.51 180 top  (outside the outline)
R16  33.72,-6.35 0 top  (outside the outline)
R17  37.21,-11.91 90 top  (outside the outline)
R18  42.77,-5.72 90 top  (outside the outline)
R19  33.72,-4.29 0 top  (outside the outline)
R20  33.88,-10.8 0 top  (outside the outline)
R21  40.23,-5.72 90 top  (outside the outline)
R22  60.55,23.49 90 top  (outside the outline)
R23  67.21,23.49 90 top  (outside the outline)
R24  28,22.23 0 top  (outside the outline)
R25  21.49,-11.59 0 bottom  (outside the outline)
R26  34.51,-14.45 0 bottom  (outside the outline)
R27  48.01,-6.99 270 top  (outside the outline)
R28  48.64,-10.32 0 top  (outside the outline)
R29  55.15,-6.51 180 top  (outside the outline)
R30  20.07,-0.16 0 top  (outside the outline)
T1  51.02,-6.83 0 top  (outside the outline)
U1  41.34,11.11 270 top  (outside the outline)
U2  22.92,6.51 0 top  (outside the outline)
U3  62.93,11.35 270 top  (outside the outline)
U4  20.38,-7.14 90 top  (outside the outline)
U5  43.8,9.05 180 bottom  (outside the outline)
U6  6.41,2.54 0 top  (outside the outline)
U7  14.03,19.37 0 top  (outside the outline)
U$1  4.51,26.19 0 top  (outside the outline)
Y1  13.72,-16.35 0 top  (outside the outline)
Y2  29.11,-16.35 180 top  (outside the outline)

### Tracks (layer width: path | path; a pad name or v marks a point on that pad's centre or on a via)
1.2V  (via drill 0.5)  (4 unrouted)
  Top 0.203: U1.P28 36.57,21.07 v35.9,20.4 | U1.P89 40.57,1.6 v40.27,1.85 | 41.11,21.23 41.13,21.23 | v42.19,20.44 42.17,20.42 41.93,20.42 41.13,21.23 | U1.P19 41.09,21.26 41.13,21.23 | U1.P52 31.48,12.36 v32.05,12.94 | U1.P128 51.02,11.86 v50.65,11.49
  Top 0.305: L2.2 22.76,16.51 26.89,12.38 30.22,12.38 U1.P52 | v35.9,20.4 35.9,18.53 v35.94,18.34 | v50.65,11.49 48.58,11.49 v48.56,11.51 | v40.27,1.85 40.27,3.93 v40.23,3.97 | v42.19,20.44 42.19,18.36 v42.21,18.34 | v34.04,12.94 v32.05,12.94
  Bottom 0.203: 36,20.28 C9.2
  Bottom 0.305: v48.56,11.51 48.56,17.78 48.01,18.34 v42.21,18.34 v35.94,18.34 35.07,18.34 34.04,17.3 v34.04,12.94 34.04,4.29 34.35,3.97 v40.23,3.97 | v32.05,12.94 32.07,12.94 C13.2
3.3V  (via drill 0.5)  (5 unrouted)
  Top 0.203: U1.P90 41.09,-2.92 41.5,-3.33 41.5,-5.71 | 41.5,-5.71 41.5,-9.37 41.18,-9.68 41.18,-15.24 42.13,-16.19 42.13,-17.14 J8.4 | R27.2 47.69,-7.93 46.58,-6.83 46.58,-6.35 45.94,-5.71 41.5,-5.71 | v40.76,20.4 40.59,20.61 U1.P20 40.59,23.28 40.76,23.46 41.4,23.46 41.59,23.27 U1.P18 | U1.P4 48.59,21 v47.99,20.4 | U1.P135 50.75,15.36 v50.63,15.24 | U1.P122 51.29,8.86 v50.55,9.6 51.3,10.36 U1.P125 | U1.P103 47.59,1.53 47.29,1.83 v46.74,1.83 | U1.P86 39.09,1.22 v38.48,1.83 | U1.P76 34.09,1.38 v33.72,1.83 31.68,3.86 U1.P69 | U1.P63 31.62,6.86 v32.05,6.43 | U1.P53 31.7,11.86 v32.05,11.51 | U1.P31 35.09,20.74 v34.67,20.32 | U1.P42 31.72,17.36 C23.2 | v49.36,13.34 49.36,12.78 49.77,12.36 U1.P129
  Top 0.305: R30.1 18.64,0.32 C27.2 20.01,6.93 v20.86,7.78 20.86,9.7 U2.8 | v43.88,13.34 v49.36,13.34 | R24.2 C25.2 31.41,22.21 U1.P36 32.59,20.97 33.24,20.32 v34.67,20.32 | C26.1 70.37,10.02 69.44,10.95 U3.33 v66.11,10.95 v66.1,10.95 | v59.12,11.91 58.96,11.75 U3.11 | U1.P90 v41.09,3.16 v41.1,3.18
  Top 0.406: J11.1 0.86,31.59 0.86,16.19 7.37,9.68 L1.2 v8.95,8.89
  Bottom 0.203: C15.2 v47.99,20.4 | C18.2 v46.74,1.83 | v38.48,1.83 C19.2 | v33.72,1.83 C20.2 | v32.05,6.43 32.05,6.39 C21.2 | C22.2 v32.05,11.51
  Bottom 0.305: 34.83,19.13 34.43,19.13 33.24,17.94 33.24,17.78 | 34.83,19.13 40.7,19.13 | 40.7,19.13 48.01,19.13 | 48.01,19.13 48.48,19.13 49.36,18.26 49.36,15.24 | 49.36,15.24 v49.36,13.34 49.36,9.92 49.75,9.53 50.47,9.53 v50.55,9.6 | 38.56,3.18 v41.1,3.18 46.26,3.18 46.74,2.7 46.74,1.86 C18.2 | 38.56,3.18 33.72,3.18 33.7,3.2 | 33.24,6.35 33.24,3.65 33.7,3.2 | 33.24,6.35 33.24,11.51 | 33.24,11.51 33.24,17.78 | v40.76,20.4 40.76,19.19 40.7,19.13 | C15.2 48.01,19.13 | v50.63,15.24 49.36,15.24 | C19.2 38.46,3.07 38.56,3.18 | C20.2 33.7,3.2 | C21.2 33.23,6.37 33.24,6.35 | v32.05,11.51 33.24,11.51 | C24.2 43.9,13.34 U5.4 43.82,13.26 v43.88,13.34 | 31.42,22.25 C25.2 | C17.2 50.59,9.6 56.82,9.6 v59.12,11.91 60.07,10.95 v66.1,10.95 66.05,10.9 J9.1 | J2.4 17.46,11.18 v20.86,7.78 | v34.67,20.32 34.67,19.29 34.83,19.13 | C23.2 33.2,17.74 33.24,17.78
  Bottom 0.406: v8.95,8.89 14.73,8.89 J2.4 | 30.7,27.62 31.02,27.62 31.5,27.15 31.5,22.32 C25.2 | 30.7,27.62 2.76,27.62 1.49,28.89 J11.1 | J12.12 30.7,27.62
  other vias: 32.05,17.74 31.4,22.23
5V  (via drill 0.5)
  Top 0.203: U4.5 U4.4 24.04,-7.78 | C32.2 29.91,-12.23
  Top 0.305: 77.22,-3.97 R5.1 74.2,-3.97 | 77.22,-3.97 78.01,-4.76 78.01,-11.04 J7.4 | R7.2 72.77,30.64 72.77,26.35 80.23,18.89 80.23,1.91 77.22,-1.11 77.22,-3.97
  Top 0.406: U4.14 U4.15 | 10.47,-3.25 C28.1 8.88,-3.33 8.73,-3.49 | U4.14 14.67,-9.05 13.08,-7.46 10.54,-7.46 10.38,-7.3 C33.2 8.88,-5.87 8.73,-5.71 | J12.1 2.76,18.57 9.91,11.43 | 9.91,11.43 10.06,11.27 10.06,1.91 8.79,0.64 8.79,-0.54 U6.3 8.73,-3.49 | 8.73,-3.49 8.73,-5.71 | L3.2 8.25,-6.19 8.73,-5.71 | U4.14 21.02,-9.05 | 21.02,-9.05 22.29,-7.78 U4.4 | C32.2 29.91,-12.38 29.11,-13.18 22.29,-13.18 21.02,-11.91 21.02,-9.05 | U7.3 v16.35,15 16.35,13.9 C30.1 | v9.91,11.27 9.91,11.43
  Bottom 0.305: J12.1 4.19,28.26 28.72,28.26 29.43,28.97 29.43,30.4 29.99,30.96 31.34,30.96 33.72,28.58 39.12,28.58 40.7,30.16 72.29,30.16 R7.2
  Bottom 0.406: v9.91,11.27 13.64,15 v16.35,15
  other vias: 74.36,32.23
AUDIO_LEFT
  Top 0.203: U1.P9 46.09,23.17 47.85,24.92 60.07,24.92 R22.2
AUDIO_RIGHT
  Top 0.203: U1.P8 46.59,23.19 48.01,24.61 51.02,24.61 52.13,23.5 66.26,23.5 R23.2
B  (via drill 0.5)  (1 unrouted)
  Top 0.203: R19.1 R16.1 R12.1 R16.1 28.38,-6.35 C6.2 | v43.4,-8.89 42.45,-8.89 41.5,-9.84 41.5,-14.6 43.4,-16.51 J8.5
  Bottom 0.203: v43.4,-8.89 35.31,-8.89 R16.1
  other vias: 32.77,-6.35
B0
  Top 0.203: U1.P79 35.59,-4.16 35.46,-4.29 R19.2
B1
  Top 0.203: U1.P80 36.09,-5.88 35.62,-6.35 R16.2
B2
  Top 0.203: U1.P81 36.59,-7.77 35.94,-8.41 R12.2
CLK  (via drill 0.5)
  Top 0.203: U1.P55 31.35,10.86 31.5,10.72 36.18,10.72 v38.72,13.26
  Bottom 0.203: v38.72,13.26 38.7,13.26 U5.3
CSYNC
  Top 0.203: U4.16 15.3,-11.59 14.99,-11.91 14.99,-17.46 15.46,-17.94 37.05,-17.94 37.69,-18.57 40.39,-18.57 40.86,-18.1 40.86,-17.2 J8.3 40.86,-17.12 40.86,-9.68 38.96,-7.78 38.96,-1.59 39.59,-0.96 U1.P87
EAR
  Top 0.203: U1.P94 43.09,-0.96 43.72,-1.59 44.35,-1.59 48.01,-5.24 R27.1 48.31,-5.73 T1.3
EXT6
  Top 0.203: U1.P58 28.17,9.36 24.51,13.02 20.54,13.02 17.37,9.84 12.61,9.84 10.06,12.38 10.06,23.02 4.03,29.05 4.03,30.32 2.76,31.59 J10.1
EXT7
  Top 0.203: U1.P57 28.14,9.86 24.67,13.34 20.38,13.34 17.21,10.16 12.76,10.16 10.38,12.54 10.38,24.61 J12.2
EXT8
  Top 0.203: U1.P56 28.12,10.36 24.83,13.65 20.22,13.65 17.05,10.48 12.92,10.48 10.7,12.7 10.7,24.77 6.41,29.05 6.41,30.32 4.51,32.23 J11.2
EXT9
  Top 0.203: J10.2 5.46,34.61 5.46,31.75 6.73,30.48 6.73,29.21 12.13,23.81 16.1,23.81 27.05,12.86 U1.P51
EXT10
  Top 0.203: J12.3 13.4,24.13 16.26,24.13 27.02,13.36 U1.P50
EXT11
  Top 0.203: J11.3 7.05,32.23 8.95,30.32 8.95,29.05 13.56,24.45 16.42,24.45 26.5,14.36 U1.P48
EXT12
  Top 0.203: J10.3 8,34.61 8,31.75 9.27,30.48 9.27,29.21 13.72,24.77 16.57,24.77 26.48,14.86 U1.P47
EXT13
  Top 0.203: J12.4 14.99,25.08 16.73,25.08 26.45,15.36 U1.P46
EXT14
  Top 0.203: J11.4 9.59,32.23 11.49,30.32 11.49,29.05 15.14,25.4 16.89,25.4 26.43,15.86 U1.P45
EXT15
  Top 0.203: J10.4 10.54,34.61 10.54,31.75 11.81,30.48 11.81,29.21 15.3,25.72 17.05,25.72 26.4,16.36 U1.P44
EXT16
  Top 0.203: J12.5 16.57,26.04 17.21,26.04 26.38,16.86 U1.P43
EXT17
  Top 0.203: J11.5 11.97,32.23 14.03,30.16 14.03,29.05 16.73,26.35 17.37,26.35 25.86,17.86 U1.P41
EXT18
  Top 0.203: J10.5 13.08,34.61 13.08,31.75 14.35,30.48 14.35,29.21 16.89,26.67 17.53,26.67 25.83,18.36 U1.P40
EXT19
  Top 0.203: U1.P35 33.09,23.17 32.77,23.5 24.99,23.5 22.45,26.04 19.11,26.04 J12.6
EXT20
  Top 0.203: U1.P34 33.59,23.47 33.24,23.81 25.15,23.81 22.61,26.35 19.27,26.35 16.57,29.05 16.57,30.16 14.51,32.23 J11.6
EXT21
  Top 0.203: U1.P33 34.09,23.76 33.72,24.13 25.31,24.13 22.76,26.67 19.43,26.67 16.89,29.21 16.89,30.48 15.62,31.75 15.62,34.61 J10.6
EXT22
  Top 0.203: U1.P32 34.59,24.05 34.2,24.45 25.46,24.45 22.92,26.99 20.7,26.99 J12.7
EXT23
  Top 0.203: U1.P30 35.59,24.48 35.31,24.77 25.62,24.77 23.08,27.31 20.86,27.31 19.11,29.05 19.11,30.16 17.05,32.23 J11.7
EXT24
  Top 0.203: U1.P29 36.09,24.62 35.62,25.08 25.78,25.08 23.24,27.62 21.02,27.62 19.43,29.21 19.43,30.48 18.16,31.75 18.16,34.61 J10.7
EXT25
  Top 0.203: U1.P27 37.09,24.57 36.26,25.4 25.94,25.4 23.4,27.94 22.29,27.94 J12.8
EXT26
  Top 0.203: U1.P26 37.59,24.86 36.74,25.72 26.1,25.72 23.56,28.26 22.45,28.26 21.65,29.05 21.65,30.16 19.59,32.23 J11.8
EXT27
  Top 0.203: U1.P24 38.59,24.66 37.21,26.04 26.26,26.04 23.72,28.58 22.61,28.58 21.97,29.21 21.97,30.48 20.7,31.75 20.7,34.61 J10.8
EXT28
  Top 0.203: U1.P23 39.09,24.63 37.37,26.35 26.42,26.35 J12.9
EXT29
  Top 0.203: U1.P22 39.59,24.61 37.53,26.67 26.58,26.67 24.19,29.05 24.19,30.16 22.13,32.23 J11.9
EXT30
  Top 0.203: U1.P21 40.09,24.59 37.69,26.99 26.73,26.99 24.51,29.21 24.51,30.48 23.24,31.75 23.24,34.61 J10.9
EXT31
  Top 0.203: U1.P17 42.09,23.38 38.16,27.31 28,27.31 J12.10
EXT32
  Top 0.203: U1.P16 42.59,23.36 38.32,27.62 28.16,27.62 26.73,29.05 26.73,30.16 24.67,32.23 J11.10
EXT33
  Top 0.203: U1.P15 43.09,23.33 38.48,27.94 28.32,27.94 27.05,29.21 27.05,30.48 25.78,31.75 25.78,34.61 J10.10
EXT34
  Top 0.203: U1.P14 43.59,23.63 38.96,28.26 29.59,28.26 J12.11
EXT35
  Top 0.203: U1.P12 44.59,23.26 39.28,28.58 33.72,28.58 31.34,30.96 28.16,30.96 J11.11
EXT36
  Top 0.203: U1.P11 45.09,23.34 | 45.09,23.34 45.09,23.4 | 45.09,23.34 39.53,28.89 34.83,28.89 30.23,33.5 29.43,33.5 J10.11
FLASH_CS  (via drill 0.5)
  Top 0.203: v27.92,19.37 U1.P38 | v23.4,7.78 23.4,7.14 21.02,4.76 U2.1
  Bottom 0.203: v27.92,19.37 28,8.73 27.53,8.26 23.88,8.26 v23.4,7.78
FLASH_HOLD
  Top 0.203: U1.P61 29.19,7.86 28.64,8.41 26.58,8.41 25.78,9.21 25.78,11.11 25.31,11.59 22.76,11.59 22.29,11.11 U2.7
FLASH_MISO
  Top 0.203: U1.P65 30.23,5.87 27.85,5.87 25.94,7.78 25.46,7.78 22.29,4.6 U2.2
FLASH_MOSI
  Top 0.203: U1.P64 27.83,6.36 24.83,9.37 U2.5 24.85,9.84
FLASH_SCK
  Top 0.203: U1.P70 28.77,3.36 26.99,1.59 21.81,1.59 21.65,1.75 21.65,4.6 24.35,7.3 24.35,8.26 23.56,9.05 U2.6
FLASH_WP  (via drill 0.5)
  Top 0.203: v25.62,6.83 23.56,3.97 U2.3 | U1.P62 28.42,7.36 v28.16,7.62
  Bottom 0.203: v28.16,7.62 26.42,7.62 v25.62,6.83
G  (via drill 0.5)  (2 unrouted)
  Top 0.203: R13.1 R17.1 36.58,-12.22 33.56,-12.22 32.92,-11.59 R20.1 32.45,-10.79 31.34,-9.68 31.34,-8.1 30.54,-7.3 C7.2 | R2.1 42.45,-10.95 41.81,-11.59 41.81,-13.97 42.93,-15.08 43.56,-15.08 44.67,-16.19 44.67,-17.14 J8.6
  Bottom 0.203: R13.1 41.5,-12.86 v43.4,-10.95
  other vias: 39.27,-12.86
G0
  Top 0.203: R20.2 37.09,-8.53 U1.P82
G1
  Top 0.203: U1.P83 37.59,-9.62 37.21,-10 R17.2
G2
  Top 0.203: U1.P84 38.09,-8.81 39.28,-10 R13.2
GND  (via drill 0.5)  (3 unrouted)
  Top 0.203: R1.2 R2.2 R3.2 | U2.4 27.17,3.13 28.4,4.36 U1.P68 31.73,4.36 v32.05,4.68 | C1.2 | J8.1 38.48,-17.09 38.48,-15.72 39.28,-14.92 D3.K 37.61,-14.6 37.45,-14.45 | C32.1 27.85,-11.75 | 52.93,-7.94 52.93,-7.78 R29.2 | T1.2 52.92,-7.93 52.93,-7.94 | C4.2 v64.99,24.45 64.99,25.08 65.63,25.72 68.8,25.72 69.44,25.08 C3.2 | 70.65,11.75 C26.2 | 14.03,12.38 C31.2 v14.03,11.91 | U1.P13 44.09,20.59 C10.1 | U1.P91 41.59,1.34 v42.05,1.83 | U1.P49 31.21,13.86 v32.05,14.68 | U1.P25 38.09,20.92 C9.1 | U1.P3 49.09,20.99 C15.1 | U1.P136 51.03,15.86 50.63,16.27 v50.63,16.99 50.63,19.37 51.12,19.86 U1.P144 | U1.P130 50.94,12.86 v50.63,13.18 | U1.P96 44.09,1.48 44.43,1.83 v45.07,1.83 | U1.P77 34.59,1.51 34.91,1.83 v36.74,1.83 | U1.P73 32.59,1.21 v31.97,1.83 | U1.P54 28.89,11.36 v28.72,11.35 | U1.P60 31.76,8.36 32.05,8.65 v32.05,9.76 | D1.A 51.02,-12.07 C2.2 52.93,-7.94 | D2.K 5.07,-14.92 5.54,-14.45 5.54,-12.57
  Top 0.305: C27.1 v18.64,8.73 | U3.12 61.89,10.95 65.09,14.15 U3.37 70.65,14.15 v70.71,14.21 C26.2 70.68,11.75 U3.34 | U3.8 58.54,14.15 v58.56,14.13 | U1.P108 50.09,4.27 v50.07,4.37 v50.07,4.36 U1.P113 | C2.2 53.33,-10.16 53.96,-10.79 54.36,-12.38 57.85,-15.87 J5.SLEEVE
  Top 0.406: U4.13 U4.12 12.92,-6.51 C33.1 C28.2 | U6.1 4.15,-3.14 C29.2 | J1.5 5.54,-12.57 9.56,-12.57 J14.1 | U4.2 26.42,-10.32 | 26.42,-10.32 27.21,-9.52 C1.2 | 27.85,-11.75 26.42,-10.32 | U7.1 11.77,13.37 13.24,11.91 v14.03,11.91 C31.2 C30.2
  Bottom 0.203: 81.5,34.77 v81.98,35.24 | C23.1 v32.05,14.68 | C25.1 29.69,22.06 29.93,21.83 | C9.1 C14.1 | C10.1 41.8,20.4 41.44,20.76 | C15.1 | C19.1 v36.74,1.83 | v31.97,1.83 C20.1 | C21.1 v32.05,4.68 | C22.1 32.03,9.78 v32.05,9.76
  other vias: 81.98,32.23 45.31,-13.02 12.29,-3.33 4.35,-3.33 28,-9.53 43.9,20.4 37.59,20.4 49.71,20.4
  pour Bottom: -0.25,36.51 85.47,36.51 85.47,-19.05 -0.25,-19.05
JOY_DOWN
  Top 0.203: J6.2 72.93,14.23 72.93,18.57 70.87,20.64 59.28,20.64 58.64,21.27 52.93,21.27 50.55,23.65 48.48,23.65 48.09,23.26 U1.P5
JOY_FIRE1
  Top 0.203: J6.6 77.34,11.27 73.57,11.27 72.61,12.22 72.61,18.26 70.55,20.32 59.12,20.32 58.48,20.96 52.77,20.96 50.39,23.34 49.75,23.34 49.59,23.17 U1.P2
JOY_FIRE2
  Top 0.203: U1.P39 30.27,18.89 32.13,18.89 33.48,17.56 48.11,17.56 50.86,20.32 58.17,20.32 58.8,19.69 64.36,19.69 65.49,18.55 71.04,18.55 71.98,17.62 71.98,10.32 73.88,8.41 76.58,8.41 78.8,10.64 78.8,12.07 78.33,12.54 76.42,12.54 75.95,13.02 75.95,18.13 J6.9
JOY_LEFT
  Top 0.203: J6.3 73.25,16.68 73.25,18.89 71.18,20.96 59.44,20.96 58.8,21.59 53.09,21.59 50.7,23.97 48.32,23.97 47.59,23.24 U1.P6
JOY_RIGHT
  Top 0.203: U1.P7 47.09,23.21 48.17,24.29 50.86,24.29 53.24,21.91 58.96,21.91 59.6,21.27 71.42,21.27 J6.4
JOY_UP
  Top 0.203: J6.1 74.34,10.02 72.29,12.07 72.29,17.94 70.89,19.35 65.49,19.35 64.83,20 58.96,20 58.32,20.64 52.61,20.64 51.02,22.23 50.1,22.23 U1.P1
L-OUT
  Top 0.203: J8.9 48.4,-17.22 48.64,-17.46 57.06,-17.46 57.69,-18.1 63.41,-18.1 64.04,-17.46 73.72,-17.46 83.25,-10.64 83.25,33.34 82.61,33.97 73.09,33.97 69.44,30.32 61.82,30.32 J4.TIP 62.77,25.72 C34.2
LED
  Top 0.203: 74.04,35.24 R6.2 73.72,35.24 69.76,31.27 59.44,31.27 58.32,30.16 58.32,26.35 57.21,25.24 47.69,25.24 45.63,23.18 45.63,22.25 U1.P10
N$1
  Top 0.305: R11.1 73.38,-13.18 J7.6
N$2
  Top 0.305: R10.1 73.66,-6.19 J7.5
N$3
  Top 0.305: R9.1 76.19,-10.79 J7.2
N$4
  Top 0.305: R8.1 75.98,-8.41 J7.1
N$5
  Top 0.203: U1.P37 28.94,19.86 27.05,21.75 R24.1 | 25.94,22.22 R24.1 | R24.1 24.03,22.23 J13.2
N$6
  Top 0.203: 50.07,-10.32 R28.2 50.07,-10.15 T1.1
N$7
  Top 0.203: R28.1 47.47,-10.54 C5.1 47.47,-13.68 48.32,-14.53 D1.K 52.13,-14.53 52.93,-13.73 C2.1
N$8
  Top 0.203: C5.2 49.75,-12.54 51.02,-11.27 51.02,-7.14 51.34,-6.83 51.66,-6.83 53.56,-4.92 58.01,-4.92 58.8,-5.71 R15.2
N$9
  Top 0.203: R29.1 57.37,-7.78 60.71,-7.78 | 60.71,-7.78 62.45,-7.78 J5.TIP | R15.1 60.7,-7.78 60.71,-7.78
N$10
  Top 0.203: R23.1 C3.1 C35.1
N$11  (1 unrouted)
  Top 0.203: C34.1 C4.1
N$12
  Top 0.406: J15.2 12.45,-12.22 J14.2 9.61,-9.98 J1.1
N$13
  Top 0.406: J15.1 11.34,-8.41 7.69,-8.41 L3.1
N$14
  Top 0.406: U6.2 6.25,-0.61 | 6.25,-0.61 C29.1 | 6.25,-0.61 6.25,1.11 3.56,3.81 3.56,7.62 4.83,8.89 L1.1
N$15
  Top 0.203: R5.2 68.96,-2.38 72.14,0.79 72.14,5.24 74.36,7.46 76.9,7.46 79.76,10.32 79.76,12.38 78.17,13.97 77.42,13.97 J6.7
N$17
  Top 0.406: C31.1 14.06,13.83 U7.2 14.03,16.24 14.03,17.3 14.83,18.1 17.69,18.1 18.8,16.98 L2.1
N$19
  Top 0.203: U4.8 C8.1
N$21
  Top 0.203: U4.7 29.81,-3.97 C7.1
N$22
  Top 0.203: U4.6 27.79,-5.24 C6.1
N$23
  Top 0.203: U4.3 26.42,-9.05 27.21,-8.25 29.27,-8.25 29.91,-8.89 C1.1 30.38,-9.52 31.18,-10.32 31.18,-12.86 27.69,-16.35 Y2.2
  Top 0.406: Y2.2 Y1.2
N$24  (via drill 0.5)
  Top 0.203: Y2.1 34.83,-16.35 35.46,-15.72 R26.1 37.85,-14.45 D3.A
  Bottom 0.406: R26.1
  other vias: 35.46,-14.45
N$25  (via drill 0.5)
  Top 0.203: v8.95,-16.35 Y1.1 5.15,-16.35 D2.A
  Bottom 0.203: R25.2 15.94,-11.59 11.18,-16.35 v8.95,-16.35
N$26  (via drill 0.5)
  Top 0.305: 54.99,34.77 C36.+ 55.31,33.66 v50.55,28.89 | v13.72,-3.97 U4.10
  Bottom 0.305: v13.72,-3.97 13.72,-3.17 8.16,2.38 7.68,2.86 6.65,3.89 6.65,10.87 16.1,20.32 31.81,20.32 36.1,24.61 48.48,24.61 50.55,26.67 v50.55,28.89
N$27
  Top 0.406: R4.1 C36.-
N$28
  Top 0.406: J3.3 52.19,27.89 R4.2
N$31
  Top 0.203: R6.1 D4.A
N$32
  Top 0.203: R7.1 D5.A
PS2_CLK
  Top 0.203: U1.P99 45.59,-0.92 48.32,-3.65 66.42,-3.65 68.33,-5.56 R10.2
PS2_DATA
  Top 0.203: U1.P98 45.09,-0.89 48.17,-3.97 64.52,-3.97 68.33,-7.78 R8.2
PS2_PIN2
  Top 0.203: R9.2 68.48,-10.32 62.45,-4.29 48.01,-4.29 44.59,-0.87 U1.P97
PS2_PIN6
  Top 0.203: U1.P95 43.56,-0.01 43.56,-0.79 43.88,-1.11 44.35,-1.11 47.85,-4.6 62.29,-4.6 67.53,-9.84 67.53,-11.75 67.54,-11.75 R11.2
R  (via drill 0.5)  (2 unrouted)
  Top 0.203: R18.1 R14.1 44.35,-7.14 44.35,-13.18 | C8.2 v29.43,-2.7 | J8.7 45.9,-15.68 44.35,-14.13 44.35,-13.18 | R3.1 44.2,-13.02 44.35,-13.18
  Bottom 0.203: R18.1 R21.1 36.26,-2.7 v29.43,-2.7
  other vias: 42.77,-6.67 40.23,-6.67
R0
  Top 0.203: U1.P88 40.09,-4.63 R21.2
R1
  Top 0.203: U1.P92 42.09,-3.13 42.77,-3.81 R18.2
R2
  Top 0.203: U1.P93 42.59,-1.41 44.83,-3.65 R14.2
R-OUT
  Top 0.203: J8.8 47.15,-16.57 48.32,-15.4 49.75,-15.4 51.34,-16.99 57.37,-16.99 58.01,-17.62 63.09,-17.62 63.72,-16.99 73.25,-16.99 82.77,-10.16 82.77,33.18 82.46,33.5 73.25,33.5 69.91,30.16 69.91,28.58 J4.RING 71.66,26.83 C35.2
SD_CS  (via drill 0.5)
  Top 0.203: U1.P59 30.21,8.89 27.37,8.89 v27.05,9.21
  Bottom 0.203: J2.1 17.24,18.57 17.53,18.57 19.43,16.67 19.43,11.91 22.13,9.21 v27.05,9.21
SD_MISO  (via drill 0.5)  (1 unrouted)
  Top 0.203: U1.P78 35.09,-2.44 34.51,-3.02 31.81,-3.02 28.8,-0.16 R30.2
  Bottom 0.203: R30.2 17.53,3.33 17.24,3.33 J2.7 17.08,3.49
  other vias: 21.02,-0.16
SD_MOSI  (via drill 0.5)
  Top 0.203: v32.29,-1.9 32.61,-1.9 33.08,-1.43 U1.P74
  Bottom 0.203: J2.2 17.08,16.19 18,16.19 18.8,15.4 18.8,11.27 24.04,6.03 27.77,6.03 30.86,2.94 30.86,-0.48 v32.29,-1.9
SD_SCK  (via drill 0.5)
  Top 0.203: U1.P75 33.59,-1.88 32.77,-2.7 31.97,-2.7 28,1.11 20.22,1.11 19.59,1.75 v19.59,4.45
  Bottom 0.203: v19.59,4.45 19.59,6.67 17.69,8.57 17.08,8.57 J2.5
STDN  (via drill 0.5)
  Top 0.203: U1.P66 26.13,5.36 v26.1,5.4 | U4.1 R25.1
  Bottom 0.203: v26.1,5.4 26.1,-0.16 22.45,-3.81 R25.1
  other vias: 22.45,-11.59
STDNB  (via drill 0.5)
  Top 0.203: U1.P67 27.31,4.86 v27.05,4.6
  Bottom 0.203: v27.05,4.6 27.05,-12.22 29.27,-14.45 R26.2
TCK
  Top 0.203: U1.P109 52.46,2.38 54.36,2.38 57.85,-1.11 61.98,-1.11 62.29,-0.79 62.29,0.28 J9.4
TDI
  Top 0.203: U1.P110 54.52,2.86 55.47,1.91 60.55,1.91 61.02,1.43 61.02,0.32 J9.5
TDO
  Top 0.203: U1.P106 49.09,-0.92 49.91,-1.75 63.88,-1.75 64.83,-0.79 64.83,0.26 J9.2
TMS
  Top 0.203: U1.P107 49.59,-0.95 50.07,-1.43 62.93,-1.43 63.56,-0.79 J9.3
VSYNC
  Top 0.203: J8.2 39.75,-17.07 39.75,-15.87 40.55,-15.08 40.55,-9.84 38.59,-7.89 U1.P85
WR
  Top 0.203: U3.15 57.11,8.57 54.99,8.57 54.78,8.36 U1.P121
XA0
  Top 0.203: U1.P141 52.49,18.42 54.2,18.42 54.46,18.15 U3.3
XA1
  Top 0.203: U3.4 U1.P139
XA2
  Top 0.203: U1.P137 52.45,16.35 54.36,16.35 54.56,16.55 U3.5
XA3
  Top 0.203: U3.6 57.09,15.72 55.15,15.72 54.3,14.86 U1.P134
XA4
  Top 0.203: U3.7 57.1,14.92 55.15,14.92 54.59,14.36 U1.P133
XA5
  Top 0.203: U3.16 57.1,7.78 54.99,7.78 54.91,7.86 U1.P120
XA6
  Top 0.203: U3.17 57.09,6.99 54.83,6.99 54.71,6.86 U1.P118
XA7
  Top 0.203: U1.P116 52.45,5.87 54.83,5.87 55.11,6.15 U3.18
XA8
  Top 0.203: U1.P114 54.77,4.86 55.26,5.35 U3.19
XA9
  Top 0.203: U3.20 57.08,4.6 55.31,4.6 54.57,3.86 U1.P112
XA10
  Top 0.203: 68.78,5.4 U3.26 69.48,5.35 69.76,5.08 69.76,0.64 66.74,-2.38 49.59,-2.38 48.17,-0.95 48.17,-0.06 U1.P104
XA11
  Top 0.203: U3.27 69.64,6.15 70.07,5.72 70.07,0.48 66.9,-2.7 48.8,-2.7 47.09,-0.99 U1.P102
XA12
  Top 0.203: U3.28 68.76,6.99 69.6,6.99 70.39,6.19 70.39,0.32 67.06,-3.02 48.64,-3.02 46.59,-0.96 U1.P101
XA13
  Top 0.203: U3.29 68.76,7.78 69.6,7.78 70.71,6.67 70.71,0.16 67.21,-3.33 48.48,-3.33 48.17,-3.02 48.09,-2.94 46.09,-0.94 U1.P100
XA14
  Top 0.203: U3.30 68.59,8.41 64.68,8.41 58.64,2.38 55.63,2.38 54.64,3.36 U1.P111
XA15
  Top 0.203: U3.38 68.7,14.92 64.99,14.92 63.03,12.96 55.05,12.96 54.65,13.36 U1.P131
XA16
  Top 0.203: U3.39 68.69,15.72 64.99,15.72 63.76,16.95 54.32,16.95 54.23,16.86 U1.P138
XA17
  Top 0.203: U3.40 68.69,16.51 65.15,16.51 63.9,17.76 54.38,17.76 54.27,17.86 U1.P140
XA18
  Top 0.203: U1.P142 52.47,18.89 54.36,18.89 54.69,18.55 64.06,18.55 65.26,17.35 U3.41
XA19
  Top 0.203: U3.25 68.68,4.6 67.69,4.6 67.21,4.13 67.21,-1.43 66.58,-2.06 49.75,-2.06 48.64,-0.95 48.64,-0.04 U1.P105
XA20
  Top 0.203: U3.42 65.26,18.15 64.06,19.34 53.37,19.34 53.34,19.37 U1.P143
XD0
  Top 0.203: U3.9 57.11,13.34 55.15,13.34 54.62,13.86 U1.P132
XD1
  Top 0.203: U3.10 55.47,12.54 54.29,11.36 U1.P127
XD2
  Top 0.203: U3.13 55.15,10.16 54.85,9.86 U1.P124
XD3
  Top 0.203: U1.P123 52.45,9.35 U3.14
XD4
  Top 0.203: U3.31 68.71,9.37 64.68,9.37 61.06,5.75 55.19,5.75 54.8,5.36 U1.P115
XD5
  Top 0.203: U3.32 64.52,10.16 60.9,6.55 55.03,6.55 54.85,6.36 U1.P117
XD6
  Top 0.203: U3.35 65.31,12.54 60.05,7.36 54.97,7.36 54.93,7.36 U1.P119
XD7
  Top 0.203: U3.36 68.71,13.34 65.15,13.34 62.37,10.56 55.07,10.56 54.74,10.86 U1.P126